# EasyEDA Pro project air-flushing-controller.epro

# Schematic Schematic1
Board Name: Board1; Create Date: 2026-10-02; Page Name: P1; Project Name: automatyzacja płukania worków; Schematic Name: Schematic1; Update Date: 2026-10-02; Company: EasyEDA.com; Page Size: A4; Version: V1.0
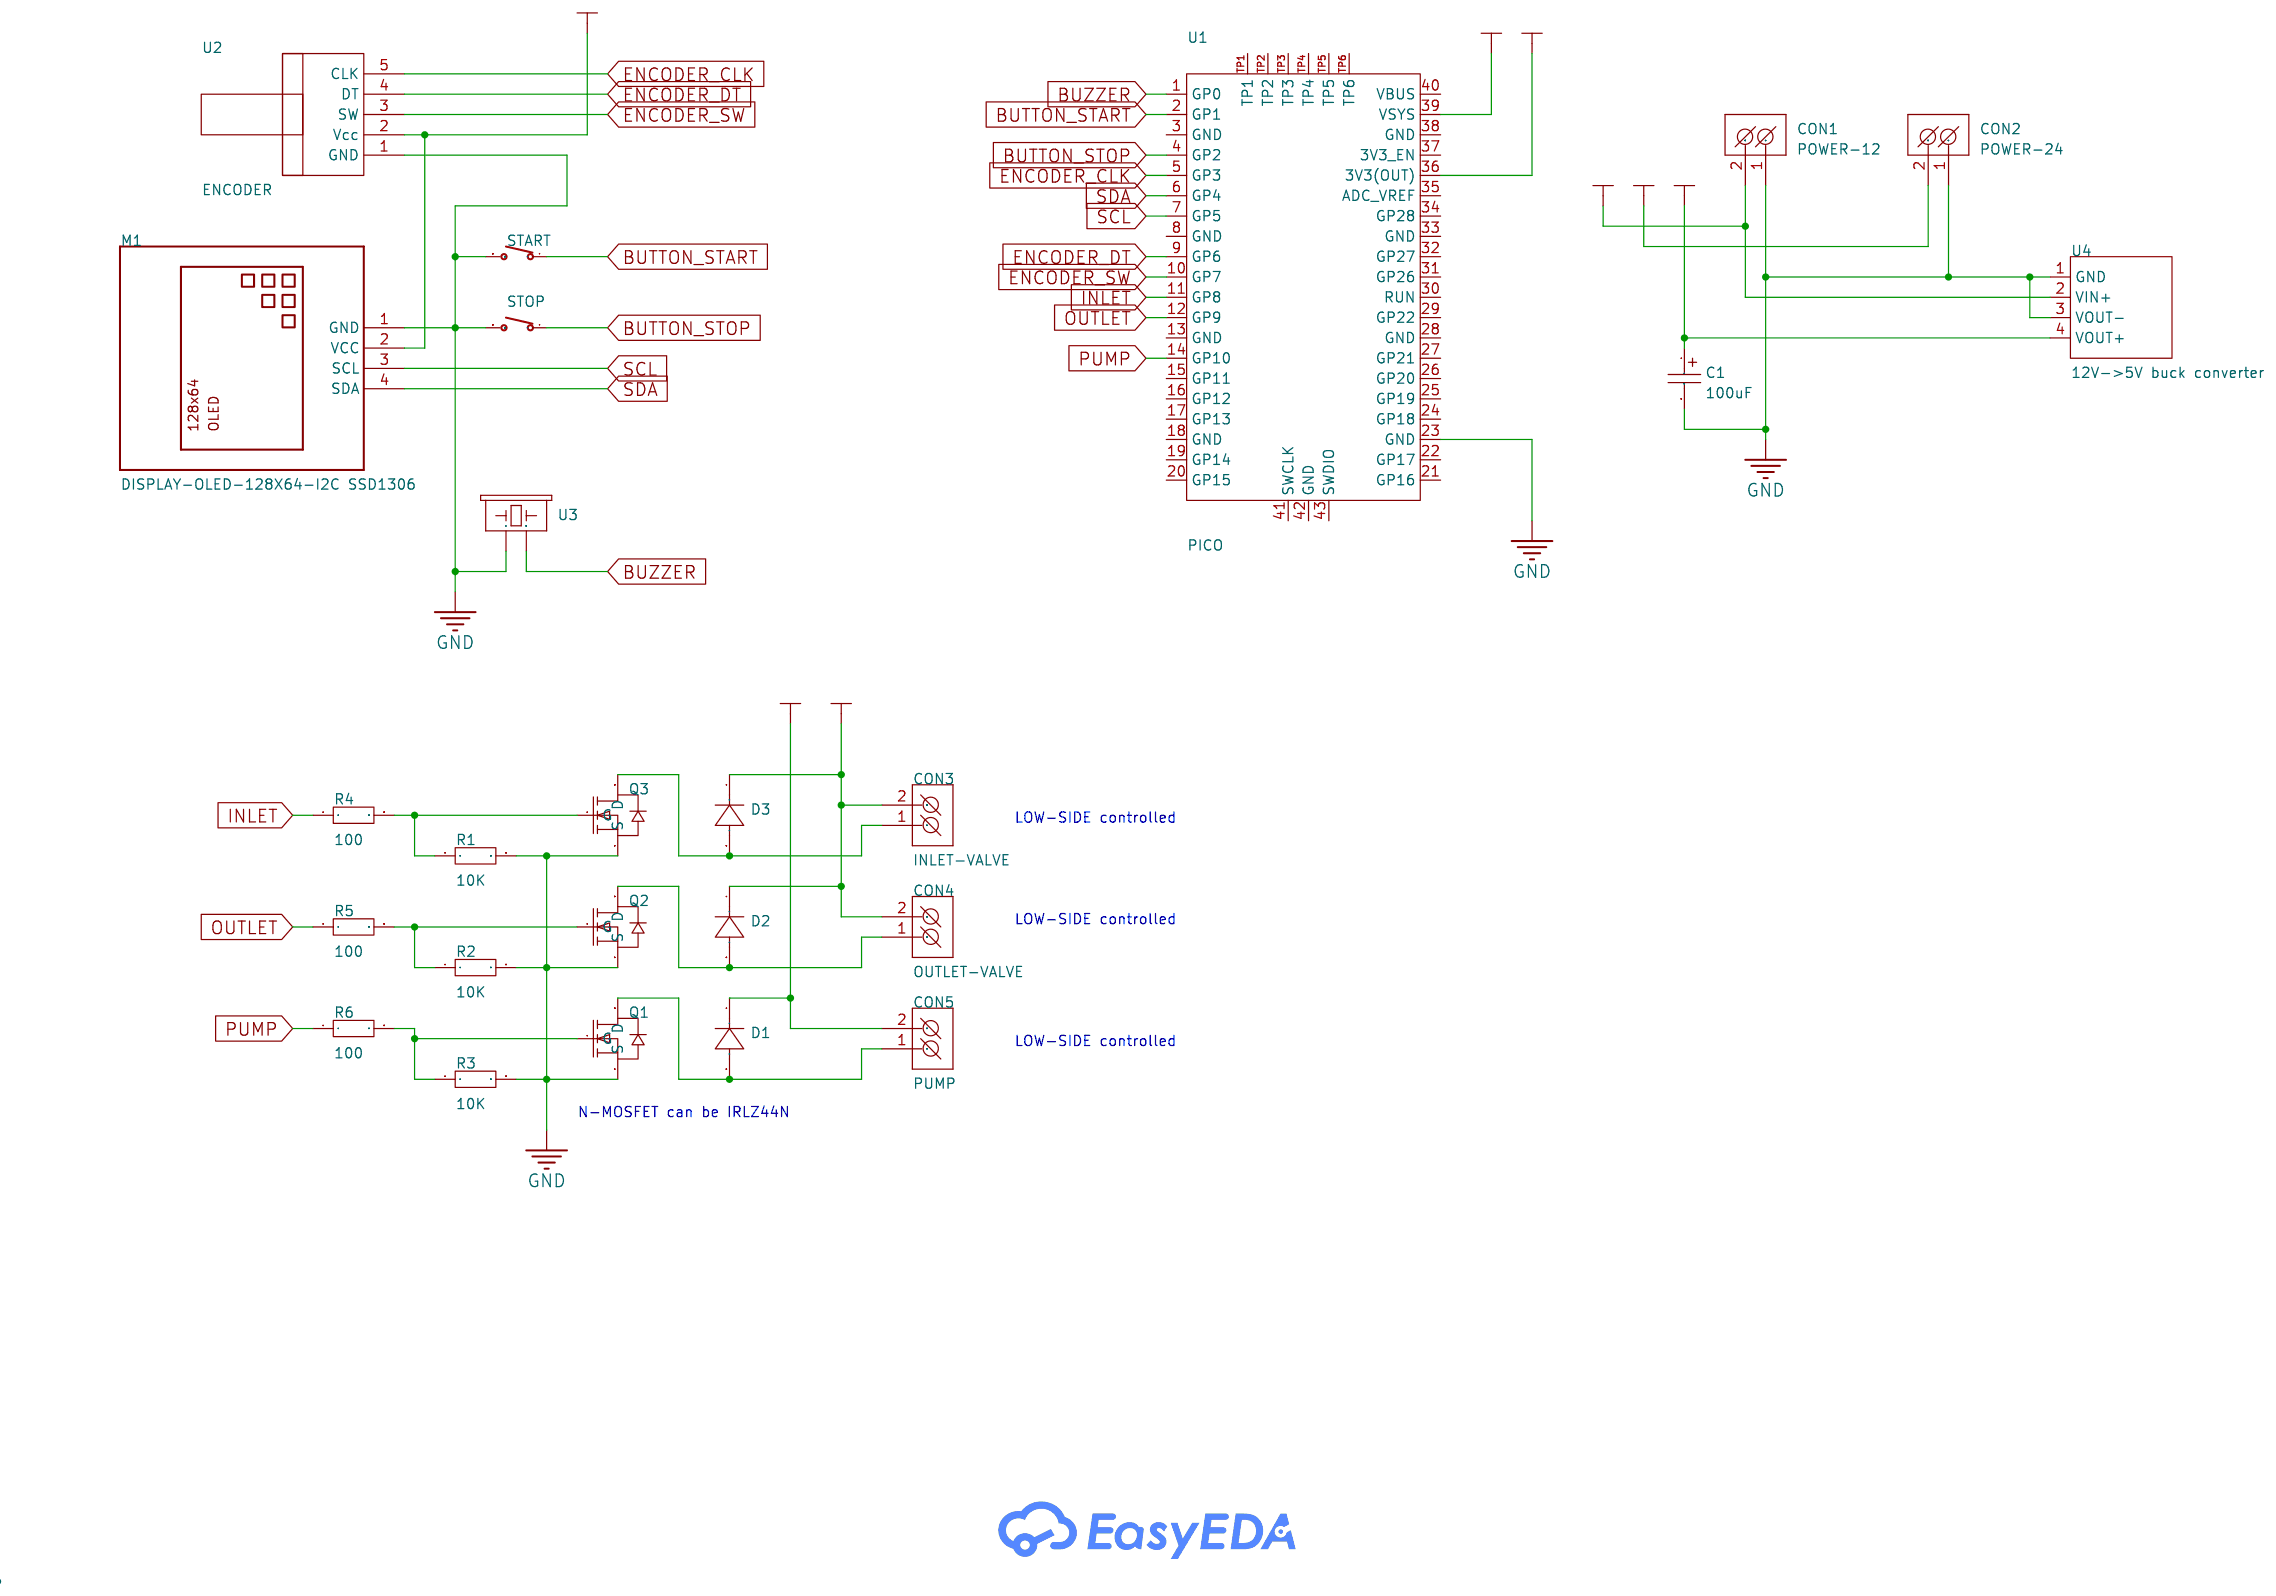
[diagram p0: schematic sheet]

## Parts
C1  100uF  [CAP-SMD_BD3.0-L3.3-W3.3-RD]
CON1  POWER-12  [ARK2]
CON2  POWER-24  [ARK2]
CON3  INLET-VALVE  [ARK2]
CON4  OUTLET-VALVE  [ARK2]
CON5  PUMP  [ARK2]
D1  -  [DO-41_BD2.4-L4.7-P8.70-D0.9-RD]
D2  -  [DO-41_BD2.4-L4.7-P8.70-D0.9-RD]
D3  -  [DO-41_BD2.4-L4.7-P8.70-D0.9-RD]
M1  DISPLAY-OLED-128X64-I2C SSD1306  [SSD1306-128X64-I2C]
Q1  -  [SOT-23-3_L2.9-W1.3-P1.90-LS2.4-BR]
Q2  -  [SOT-23-3_L2.9-W1.3-P1.90-LS2.4-BR]
Q3  -  [SOT-23-3_L2.9-W1.3-P1.90-LS2.4-BR]
R1  10K  [R0603]
R2  10K  [R0603]
R3  10K  [R0603]
R4  100  [R0603]
R5  100  [R0603]
R6  100  [R0603]
START  1S1P momentary switch
STOP  1S1P momentary switch
U1  PICO  [COMM-SMD_L51.0-W21.0-P2.54_SC0916]
U2  ENCODER
U3  -
U4  12V->5V buck converter  [PWRM-TH_4P-L11.5-W6.0-P2.54_ZY0305FM-1W]

## Library data of the parts
C1 = C_Ele_SMD_3x5.4mm: Supplier Footprint: SMD,3x5.4mm
CON1-CON5 = ARK2
D1-D3 = 1N4007: Supplier Footprint: DO-41
M1 = DISPLAY-OLED-128X64-I2C SSD1306
Q1-Q3 = N_MOS: Supplier Footprint: SOT-23
R1-R6 = Res_0603: Supplier Footprint: 0603
START STOP = momentary switch: Supplier: LCSC; Supplier Part: C318884; Manufacturer: XKB Connectivity(中国星坤); Manufacturer Part: TS-1187A-B-A-B; JLCPCB Part Class: Basic Part; Supplier Footprint: SMD; Datasheet: https://atta.szlcsc.com/upload/public/pdf/source/20200227/C318890_053E50208A88A7BA1965D8746000774E.pdf; Circuit: SPST; Actuator Style: Round Button; Operating Force: 160gf; Mounting Style: Brick nogging; Switch Length: 5.1mm; Switch Width: 5.1mm; Switch Height: 1.5mm; Strike Gundam: 不带; Contact Current: 50mA; Voltage Rating (DC): 12V; Actuator/Cap Color: 金色; With Lamp: No; Mechanical Life: 10万次; Operating Temperature: -30℃~+85℃
U1 = PICO: LCSC Part Name: 基于RP2040的微控制器开发板; Supplier Part: C7203002; Manufacturer: Raspberry Pi(树莓派); JLCPCB Part Class: Extended Part; Datasheet: https://item.szlcsc.com/datasheet/PICO/8170960.html; Supplier: LCSC
U2 = ENCODER
U3 = BUZZER
U4 = ISOLATED DC-DC Converter AIDC5V5V200MATH: Type:- Number of Outputs:- Output Power:1W Voltage - Supply:4.5V~5.5V Voltage - Supply:4.5V~5.5V Conversion Efficiency:77% Conversion Efficiency:77% Output Voltage:5V Output Voltage:5V Output Current(Max):200mA Output Current(Max):200mA Capacitive Load(Ma; Supplier Part: C19762999; Manufacturer: Analog; JLCPCB Part Class: Extended Part; Datasheet: https://item.szlcsc.com/datasheet/ISOLATED%2520DC-DC%2520Converter%2520AIDC5V5V200MATH/21088909.html; Supplier: LCSC; Output Power: 1W; Voltage - Supply: 4.5V~5.5V; Conversion Efficiency: 77%; Output Voltage: 5V; Output Current(Max): 200mA; Capacitive Load(Max): 470uF; Isolation Voltage(Vrms): 1.5kV; Features: Short Circuit Protection; Operating Temperature: -40℃~+85℃; Ripple Noise: 75mVp-p

## Nets
3V3: M1.2(VCC) U1.36(3V3(OUT)) U2.2(Vcc)
5V: C1.1 U1.39(VSYS) U4.4(VOUT+)
12V: CON1.2(K2) CON5.2(K2) D1.1(K) U4.2(VIN+)
24V: CON2.2(K2) CON3.2(K2) CON4.2(K2) D2.1(K) D3.1(K)
GND: C1.2 CON1.1(K1) CON2.1(K1) M1.1(GND) Q1.2(S) Q2.2(S) Q3.2(S) R1.2 R2.2 R3.2 START.B STOP.B U1.1(GP0) U1.23(GND) U2.1(GND) U3.(1) U4.1(GND) U4.3(VOUT−)
BUTTON_START: START.A U1.2(GP1)
BUTTON_STOP: STOP.A U1.4(GP2)
ENCODER_CLK: U1.5(GP3) U2.5(CLK)
ENCODER_DT: U1.9(GP6) U2.4(DT)
ENCODER_SW: U1.10(GP7) U2.3(SW)
INLET: R4.1 U1.11(GP8)
OUTLET: R5.1 U1.12(GP9)
PUMP: R6.1 U1.14(GP10)
SCL: M1.3(SCL) U1.7(GP5)
SDA: M1.4(SDA) U1.6(GP4)
Net-(CON3-1): CON3.1(K1) D3.2(A) Q3.3(D)
Net-(CON4-1): CON4.1(K1) D2.2(A) Q2.3(D)
Net-(CON5-1): CON5.1(K1) D1.2(A) Q1.3(D)
Net-(Q1-1): Q1.1(G) R3.1 R6.2
Net-(Q2-1): Q2.1(G) R2.1 R5.2
Net-(Q3-1): Q3.1(G) R1.1 R4.2

Not connected (* = marked no-connect by the designer): U1 3(GND) 8(GND) 13(GND) 15(GP11) 16(GP12) 17(GP13) 18(GND) 19(GP14) 20(GP15) 21(GP16) 22(GP17) 24(GP18) 25(GP19) 26(GP20) 27(GP21) 28(GND) 29(GP22) 30(RUN) 31(GP26) 32(GP27) 33(GND) 34(GP28) 35(ADC_VREF) 37(3V3_EN) 38(GND) 40(VBUS) 41(SWCLK) 42(GND) 43(SWDIO) TP1 TP2 TP3 TP4 TP5 TP6

## Notes on the sheet
- LOW-SIDE controlled
- LOW-SIDE controlled
- LOW-SIDE controlled
- N-MOSFET can be IRLZ44N
